# Altium schematic sheet COMM.SchDoc: =ProjectName
size A4; CheckedBy: DatNB; Author: Ven; CompanyName: Nacentech; Organization: IMET
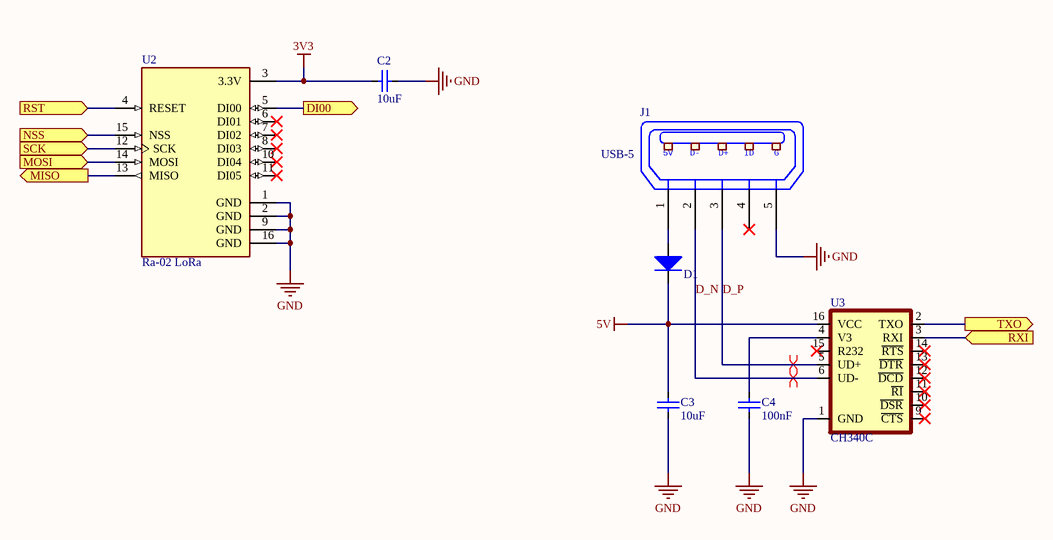
[diagram p0: COMM.SchDoc]

## Parts
C2  10uF  [CAP_0805]
C3  10uF  [CAP_0805]
C4  100nF  [CAP_0805]
D1  Diode SMD  [DIO-214AC(SMA)]  (value not drawn)
J1  USB-5  [USB-M1]
U2  Ra-02 LoRa  [Ra-02]
U3  CH340C  [SOP-16]

## Ports
DI00 (out), MISO (out), MOSI (in), NSS (in), RST (in), RXI (in), SCK (in), TXO (out)

## Nets
3V3: C2.2 U2.3(3.3V)
5V: C3.2 D1.2(K) U3.16(VCC)
GND: C2.1 C3.1 C4.1 J1.5(P5) U2.1(GND) U2.2(GND) U2.9(GND) U2.16(GND) U3.1(GND)
D_N: J1.2(P2) U3.6(UD-)
D_P: J1.3(P3) U3.5(UD+)
DI00: U2.5(DI00) ; port DI00
MISO: U2.13(MISO) ; port MISO
MOSI: U2.14(MOSI) ; port MOSI
NSS: U2.15(NSS) ; port NSS
RST: U2.4(RESET) ; port RST
RXI: U3.3(RXI) ; port RXI
SCK: U2.12(SCK) ; port SCK
TXO: U3.2(TXO) ; port TXO
NetC4_2: C4.2 U3.4(V3)
NetD1_1: D1.1(A) J1.1(P1)

Not connected (* = marked no-connect by the designer): J1 4(P4)*; U2 6(DI01)* 7(DI02)* 8(DI03)* 10(DI04)* 11(DI05)*; U3 9(~{CTS})* 10(~{DSR})* 11(~{RI})* 12(~{DCD})* 13(~{DTR})* 14(~{RTS})* 15(R232)*

## Layout directives
differential pair: D_N, D_P

## Notes on the sheet
- Project:
- Page Contents:
- Size:
- Date:
- A4
- Checked by:
- Time:
- Revision:
- Sheet
- of
- File:
- (in symbol USB-5) 5V; D-; D+; ID; G

## Library data of the parts
C2-C4 = CapSMD: Capacitor; Value: 33p; Published: 8-Jun-2000; LatestRevisionDate: 17-Jul-2002; LatestRevisionNote: Re-released for DXP Platform.; PackageReference: RAD-0.3; Publisher: Altium Limited
D1 = Diode SMD: Default Diode; Code - JEDEC: DO-214-AB; Value: 1N5007; Published: 8-Jun-2000; Revision: July-2002: Re-released for DXP Platform.; Publisher: Altium Limited
J1 = USB-5: Manufacturer: FCI; Manufacturer Part Number: 10118193-0001LF; Connector Type: USB - micro B; Number of Contacts: 5; Gender: Receptacle; Specifications: USB 2.0; .Creator: MM; .Checked PCB: RF; Supplier 1: Digi-Key; RoHS: RoHS Compliant; Category: Connectors, Interconnects; Stock 1: 28642; Pricing 1: 1=0.46, 10=0.433, 25=0.3712, 50=0.3156, 100=0.3032, 250=0.27224, 500=0.25988 (USD); Packaging: Cut Tape (CT); Mounting Type: Surface Mount, Right Angle, Horizontal; Features: Shielded, Solder Retention; Ingress Protection: -; ComponentLink1URL: http://portal.fciconnect.com/Comergent//fci/drawing/10118193.pdf; ComponentLink1Description: http://portal.fciconnect.com/Comergent//fci/drawing/10118193.pdf; Supplier Part Number 1: 609-4616-1-ND; .Checked SCH: MM
U2 = Ra-02 LoRa: LoRa Module Ra-02
U3 = CH340C: USB to serial chip CH340; MF: WCH; Package: Package; Check_prices: https://www.snapeda.com/parts/CH340C/WCH/view-part/5428851/?ref=eda; Value: *; Price: None; MP: CH340C; Availability: Unavailable; SnapEDA_Link: https://www.snapeda.com/parts/CH340C/WCH/view-part/5428851/?ref=snap